# EAGLE schematic M8650D+cpld+ (EAGLE 6.6.0)

## Sheet 1 of 3
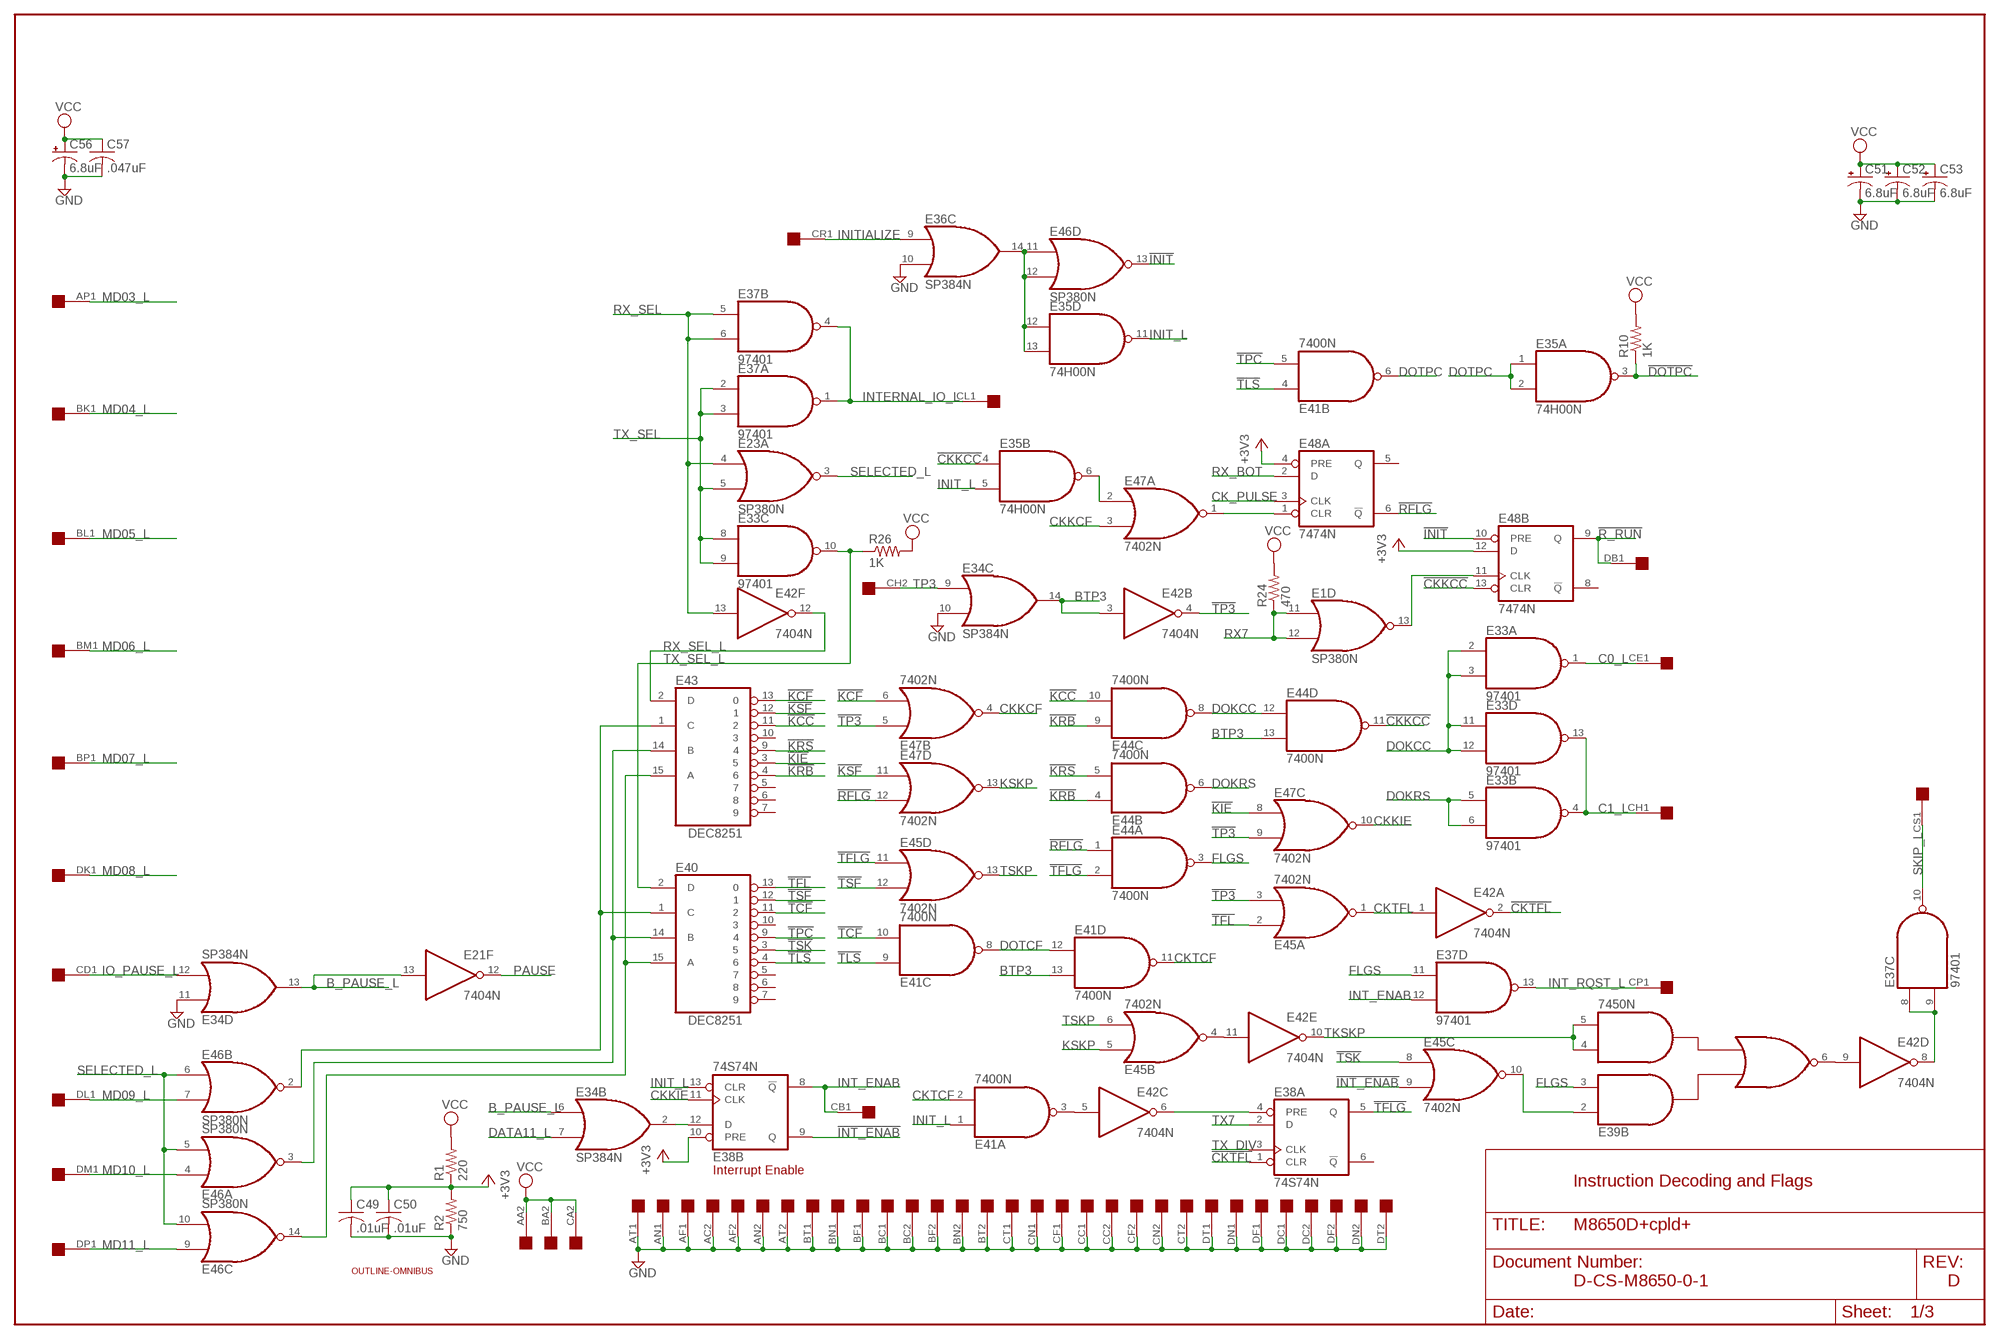
[diagram p0: schematic, sheet 1]

### Parts
C49  .01uF  C-US050-025X075  [C050-025X075]
C50  .01uF  C-US050-025X075  [C050-025X075]
C51  6.8uF  CPOL-USE20-8AXIAL  [E12-8]
C52  6.8uF  CPOL-USE20-8AXIAL  [E12-8]
C53  6.8uF  CPOL-USE20-8AXIAL  [E12-8]
C56  6.8uF  CPOL-USE20-8AXIAL  [E12-8]
C57  .047uF  C-US050-025X075  [C050-025X075]
E1  SP380N  [DIL14]
E21  7404N  [DIL14]
E23  SP380N  [DIL14]
E33  97401  74LS01N  [DIL14]
E34  SP384N  [DIL14]
E35  74H00N  7400N  [DIL14]
E36  SP384N  [DIL14]
E37  97401  74LS01N  [DIL14]
E38  74S74N  [DIL14]
E39  7450N  [DIL14]
E40  DEC8251  [DIL16]
E41  7400N  [DIL14]
E42  7404N  [DIL14]
E43  DEC8251  [DIL16]
E44  7400N  [DIL14]
E45  7402N  [DIL14]
E46  SP380N  [DIL14]
E47  7402N  [DIL14]
E48  7474N  74S74N  [DIL14]
R1  220  R-US_0207/10  [0207/10]
R2  750  R-US_0207/10  [0207/10]
R10  1K  R-US_0207/10  [0207/10]
R24  470  R-US_0207/10  [0207/10]
R26  1K  R-US_0207/10  [0207/10]
U$1  OUTLINE-OMNIBUS  [OMNIBUS]
U$2  OMNIBUS  QUAD  [EDGE-CON8]

### Nets
!CKKCC: E35.4(B:I0) E44.11(D:O) E48.13(B:CLR)
!CKTFL: E38.1(A:CLR) E42.2(A:O)
!DOTPC: E35.3(A:O) R10.1 ; also sheet 2
!INIT: E46.13(D:O) E48.10(B:PRE) ; also sheet 2
!INT_ENAB: E38.9(B:Q) E45.9(C:I1)
!KCC: E43.11 E44.10(C:I1)
!KCF: E43.13 E47.6(B:I1)
!KIE: E43.3 E47.8(C:I0)
!KRB: E43.4 E44.4(B:I0) E44.9(C:I0)
!KRS: E43.9 E44.5(B:I1)
!KSF: E43.12 E47.11(D:I0)
!R_RUN: E48.9(B:Q) U$2.DB1
!RFLG: E44.1(A:I0) E47.12(D:I1) E48.6(A:!Q)
!TCF: E40.11 E41.10(C:I1)
!TFL: E40.13 E45.2(A:I0)
!TFLG: E38.5(A:Q) E44.2(A:I1) E45.11(D:I0)
!TLS: E40.4 E41.4(B:I0) E41.9(C:I0)
!TP3: E42.4(B:O) E45.3(A:I1) E47.5(B:I0) E47.9(C:I1)
!TPC: E40.9 E41.5(B:I1)
!TSF: E40.12 E45.12(D:I1)
!TSK: E40.3 E45.8(C:I0)
+3V3 [Supply]: C49.1 C50.1 E38.10(B:PRE) E48.4(A:PRE) E48.12(B:D) R1.1 R2.2 ; also sheet 2
B_PAUSE_L: E21.13(F:I) E34.6(B:I0) E34.13(D:O)
BTP3: E34.14(C:O) E41.13(D:I1) E42.3(B:I) E44.13(D:I1) ; also sheet 2
C0_L: E33.1(A:O) U$2.CE1
C1_L: E33.4(B:O) E33.13(D:O) U$2.CH1
CK_PULSE: E48.3(A:CLK) ; also sheet 2
CKKCF: E47.3(A:I1) E47.4(B:O)
CKKIE: E38.11(B:CLK) E47.10(C:O)
CKTCF: E41.2(A:I1) E41.11(D:O)
CKTFL: E42.1(A:I) E45.1(A:O)
DATA11_L: E34.7(B:I1) ; also sheet 2
DOKCC: E33.2(A:I0) E33.3(A:I1) E33.11(D:I0) E33.12(D:I1) E44.8(C:O) E44.12(D:I0)
DOKRS: E33.5(B:I0) E33.6(B:I1) E44.6(B:O) ; also sheet 2
DOTCF: E41.8(C:O) E41.12(D:I0)
DOTPC: E35.1(A:I0) E35.2(A:I1) E41.6(B:O) ; also sheet 2,3
FLGS: E37.11(D:I0) E39.3(B:I2) E44.3(A:O)
GND [Supply]: C49.2 C50.2 C51.- C52.- C53.- C56.- C57.2 E34.10(C:I1) E34.11(D:I0) E36.10(C:I1) R2.1 U$2.AC2 U$2.AF1 U$2.AF2 U$2.AN1 U$2.AN2 U$2.AT1 U$2.AT2 U$2.BC1 U$2.BC2 U$2.BF1 U$2.BF2 U$2.BN1 U$2.BN2 U$2.BT1 U$2.BT2 U$2.CC1 U$2.CC2 U$2.CF1 U$2.CF2 U$2.CN1 U$2.CN2 U$2.CT1 U$2.CT2 U$2.DC1 U$2.DC2 U$2.DF1 U$2.DF2 U$2.DN1 U$2.DN2 U$2.DT1 U$2.DT2 ; also sheet 2,3
INIT_L: E35.5(B:I1) E35.11(D:O) E38.13(B:CLR) E41.1(A:I0) ; also sheet 2
INITIALIZE: E36.9(C:I0) U$2.CR1
INT_ENAB: E37.12(D:I1) E38.8(B:!Q) U$2.CB1
INT_RQST_L: E37.13(D:O) U$2.CP1
INTERNAL_IO_L: E37.1(A:O) E37.4(B:O) U$2.CL1
IO_PAUSE_L: E34.12(D:I1) U$2.CD1
KSKP: E45.5(B:I0) E47.13(D:O)
MD03_L: U$2.AP1 ; also sheet 3
MD04_L: U$2.BK1 ; also sheet 3
MD05_L: U$2.BL1 ; also sheet 3
MD06_L: U$2.BM1 ; also sheet 3
MD07_L: U$2.BP1 ; also sheet 3
MD08_L: U$2.DK1 ; also sheet 3
MD09_L: E46.7(B:I1) U$2.DL1
MD10_L: E46.4(A:I0) U$2.DM1
MD11_L: E46.9(C:I0) U$2.DP1
N$8: E34.2(B:O) E38.12(B:D)
N$10: E42.11(E:I) E45.4(B:O)
N$14: E35.12(D:I0) E35.13(D:I1) E36.14(C:O) E46.11(D:I0) E46.12(D:I1)
N$16: E41.3(A:O) E42.5(C:I)
N$17: E38.4(A:PRE) E42.6(C:O)
N$19: E39.2(B:I1) E45.10(C:O)
N$20: E39.6(B:O) E42.9(D:I)
N$21: E40.14(B) E43.14(B) E46.3(A:O)
N$22: E37.8(C:I0) E37.9(C:I1) E42.8(D:O)
N$23: E40.1(C) E43.1(C) E46.2(B:O)
N$25: E40.15(A) E43.15(A) E46.14(C:O)
N$26: E1.13(D:O) E48.11(B:CLK)
N$28: E47.1(A:O) E48.1(A:CLR)
N$29: E35.6(B:O) E47.2(A:I0)
PAUSE: E21.12(F:O) ; also sheet 3
RX7: E1.11(D:I0) E1.12(D:I1) R24.1 ; also sheet 2
RX_BOT: E48.2(A:D) ; also sheet 2
RX_SEL: E23.4(A:I0) E37.5(B:I0) E37.6(B:I1) E42.13(F:I) ; also sheet 3
RX_SEL_L: E42.12(F:O) E43.2(D)
SELECTED_L: E23.3(A:O) E46.5(A:I1) E46.6(B:I0) E46.10(C:I1)
SKIP_L: E37.10(C:O) U$2.CS1
TKSKP: E39.4(B:I3) E39.5(B:I4) E42.10(E:O)
TP3: E34.9(C:I0) U$2.CH2 ; also sheet 3
TSKP: E45.6(B:I1) E45.13(D:O)
TX7: E38.2(A:D) ; also sheet 2
TX_DIV: E38.3(A:CLK) ; also sheet 2
TX_SEL: E23.5(A:I1) E33.8(C:I0) E33.9(C:I1) E37.2(A:I0) E37.3(A:I1) ; also sheet 3
TX_SEL_L: E33.10(C:O) E40.2(D) R26.1
VCC [Supply]: C51.+ C52.+ C53.+ C56.+ C57.1 R1.2 R10.2 R24.2 R26.2 U$2.AA2 U$2.BA2 U$2.CA2 ; also sheet 2,3
Unconnected: E1.2(B:O) E1.6(B:I0) E1.7(B:I1) E1.9(C:I0) E1.10(C:I1) E1.14(C:O) E34.3(A:O) E34.4(A:I0) E34.5(A:I1) E36.2(B:O) E36.6(B:I0) E36.7(B:I1) E38.6(A:!Q) E40.5 E40.6 E40.7 E40.10 E43.5 E43.6 E43.7 E43.10 E48.5(A:Q) E48.8(B:!Q) U$2.AA1 U$2.AB2 U$2.AC1 U$2.AD1 U$2.AD2 U$2.AE1 U$2.AE2 U$2.AH1 U$2.AH2 U$2.AJ1 U$2.AJ2 U$2.AK1 U$2.AK2 U$2.AL1 U$2.AL2 U$2.AM1 U$2.AM2 U$2.AP2 U$2.AR1 U$2.AR2 U$2.AS1 U$2.AS2 U$2.AU1 U$2.AU2 U$2.AV1 U$2.AV2 U$2.BB2 U$2.BD1 U$2.BD2 U$2.BE1 U$2.BE2 U$2.BH1 U$2.BH2 U$2.BJ1 U$2.BJ2 U$2.BK2 U$2.BL2 U$2.BM2 U$2.BP2 U$2.BR2 U$2.BS2 U$2.BU2 U$2.CB2 U$2.CD2 U$2.CE2 U$2.CJ1 U$2.CJ2 U$2.CK1 U$2.CK2 U$2.CL2 U$2.CM1 U$2.CM2 U$2.CP2 U$2.CR2 U$2.CS2 U$2.CU1 U$2.CU2 U$2.CV1 U$2.CV2 U$2.DA1 U$2.DA2 U$2.DB2 U$2.DD1 U$2.DD2 U$2.DE1 U$2.DE2 U$2.DH1 U$2.DH2 U$2.DJ1 U$2.DJ2 U$2.DK2 U$2.DL2 U$2.DM2 U$2.DP2 U$2.DR2 U$2.DS2 U$2.DU2 U$2.DV2

### Notes on the sheet
- Interrupt Enable
- Instruction Decoding and Flags
- D-CS-M8650-0-1 | D

## Sheet 2 of 3
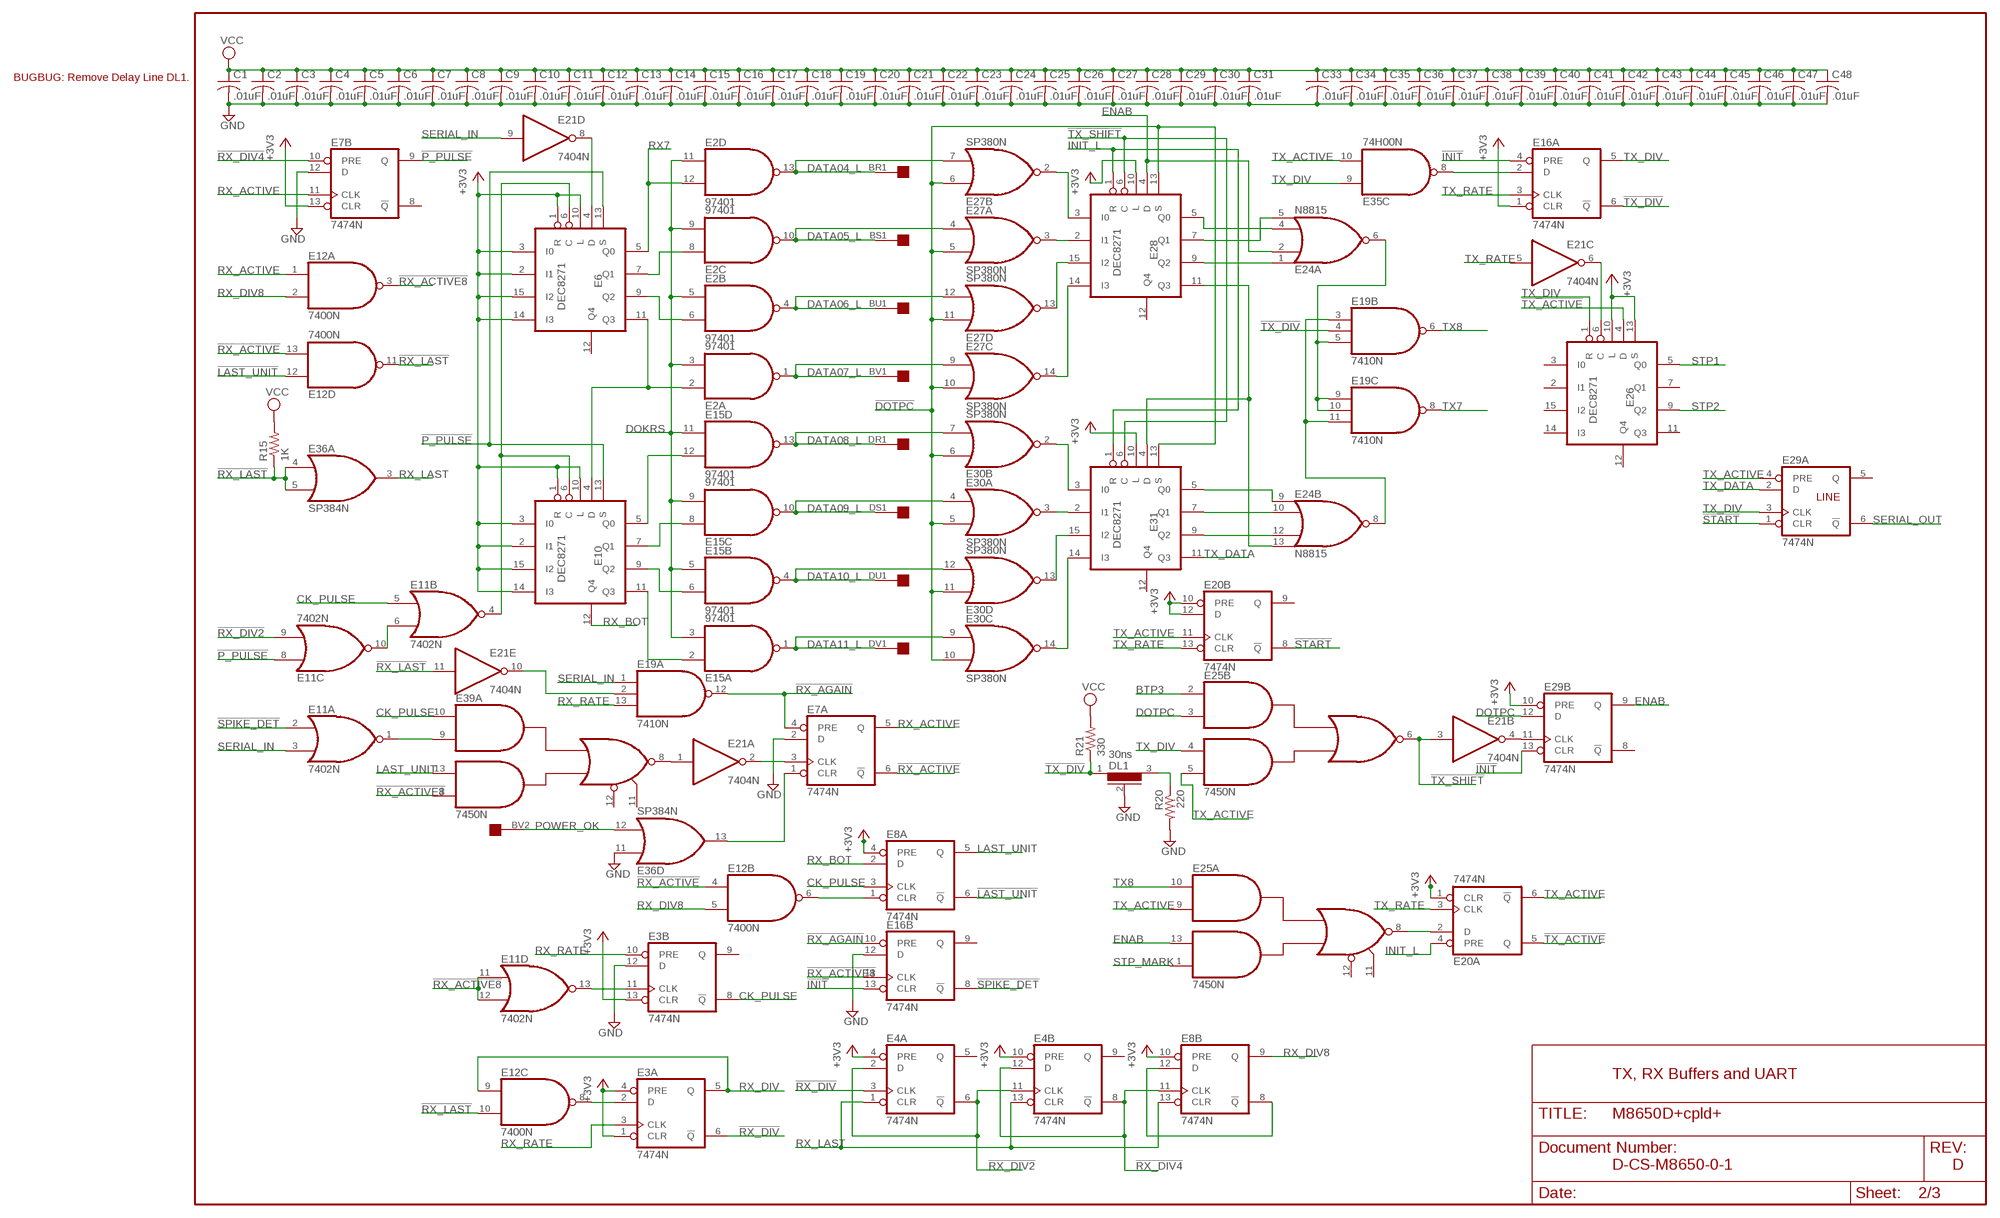
[diagram p1: schematic, sheet 2]

### Parts
C1  .01uF  C-US050-025X075  [C050-025X075]
C2  .01uF  C-US050-025X075  [C050-025X075]
C3  .01uF  C-US050-025X075  [C050-025X075]
C4  .01uF  C-US050-025X075  [C050-025X075]
C5  .01uF  C-US050-025X075  [C050-025X075]
C6  .01uF  C-US050-025X075  [C050-025X075]
C7  .01uF  C-US050-025X075  [C050-025X075]
C8  .01uF  C-US050-025X075  [C050-025X075]
C9  .01uF  C-US050-025X075  [C050-025X075]
C10  .01uF  C-US050-025X075  [C050-025X075]
C11  .01uF  C-US050-025X075  [C050-025X075]
C12  .01uF  C-US050-025X075  [C050-025X075]
C13  .01uF  C-US050-025X075  [C050-025X075]
C14  .01uF  C-US050-025X075  [C050-025X075]
C15  .01uF  C-US050-025X075  [C050-025X075]
C16  .01uF  C-US050-025X075  [C050-025X075]
C17  .01uF  C-US050-025X075  [C050-025X075]
C18  .01uF  C-US050-025X075  [C050-025X075]
C19  .01uF  C-US050-025X075  [C050-025X075]
C20  .01uF  C-US050-025X075  [C050-025X075]
C21  .01uF  C-US050-025X075  [C050-025X075]
C22  .01uF  C-US050-025X075  [C050-025X075]
C23  .01uF  C-US050-025X075  [C050-025X075]
C24  .01uF  C-US050-025X075  [C050-025X075]
C25  .01uF  C-US050-025X075  [C050-025X075]
C26  .01uF  C-US050-025X075  [C050-025X075]
C27  .01uF  C-US050-025X075  [C050-025X075]
C28  .01uF  C-US050-025X075  [C050-025X075]
C29  .01uF  C-US050-025X075  [C050-025X075]
C30  .01uF  C-US050-025X075  [C050-025X075]
C31  .01uF  C-US050-025X075  [C050-025X075]
C33  .01uF  C-US050-025X075  [C050-025X075]
C34  .01uF  C-US050-025X075  [C050-025X075]
C35  .01uF  C-US050-025X075  [C050-025X075]
C36  .01uF  C-US050-025X075  [C050-025X075]
C37  .01uF  C-US050-025X075  [C050-025X075]
C38  .01uF  C-US050-025X075  [C050-025X075]
C39  .01uF  C-US050-025X075  [C050-025X075]
C40  .01uF  C-US050-025X075  [C050-025X075]
C41  .01uF  C-US050-025X075  [C050-025X075]
C42  .01uF  C-US050-025X075  [C050-025X075]
C43  .01uF  C-US050-025X075  [C050-025X075]
C44  .01uF  C-US050-025X075  [C050-025X075]
C45  .01uF  C-US050-025X075  [C050-025X075]
C46  .01uF  C-US050-025X075  [C050-025X075]
C47  .01uF  C-US050-025X075  [C050-025X075]
C48  .01uF  C-US050-025X075  [C050-025X075]
DL1  30ns  RCL-L-00-05  [RCL-L-00-05]
E2  97401  74LS01N  [DIL14]
E3  7474N  74S74N  [DIL14]
E4  7474N  74S74N  [DIL14]
E6  DEC8271  [DIL16]
E7  7474N  74S74N  [DIL14]
E8  7474N  74S74N  [DIL14]
E10  DEC8271  [DIL16]
E11  7402N  [DIL14]
E12  7400N  [DIL14]
E15  97401  74LS01N  [DIL14]
E16  7474N  74S74N  [DIL14]
E19  7410N  [DIL14]
E20  7474N  74S74N  [DIL14]
E24  N8815  [DIL14]
E25  7450N  [DIL14]
E26  DEC8271  [DIL16]
E27  SP380N  [DIL14]
E28  DEC8271  [DIL16]
E29  7474N  74S74N  [DIL14]
E30  SP380N  [DIL14]
E31  DEC8271  [DIL16]
R15  1K  R-US_0207/10  [0207/10]
R20  220  R-US_0207/10  [0207/10]
R21  330  R-US_0207/10  [0207/10]

### Nets
!DOTPC: E27.5(A:I1) E27.6(B:I0) E27.10(C:I1) E27.11(D:I0) E28.13(S) E30.5(A:I1) E30.6(B:I0) E30.10(C:I1) E30.11(D:I0) E31.13(S) ; also sheet 1
!INIT: E16.4(A:PRE) E16.13(B:CLR) E29.13(B:CLR) ; also sheet 1
!LAST_UNIT: E8.6(A:!Q) E12.12(D:I0)
!P_PULSE: E6.13(S) E7.9(B:Q) E10.13(S) E11.8(C:I0)
!RX_ACTIVE: E7.6(A:!Q) E12.4(B:I0) E12.13(D:I1)
!RX_ACTIVE8: E11.11(D:I0) E11.12(D:I1) E12.3(A:O) E16.11(B:CLK) E39.1(A:I4)
!RX_AGAIN: E7.4(A:PRE) E16.10(B:PRE) E19.12(A:O)
!RX_DIV: E3.6(A:!Q) E4.3(A:CLK)
!RX_DIV2: E4.2(A:D) E4.6(A:!Q) E4.11(B:CLK) E11.9(C:I1)
!RX_DIV4: E4.8(B:!Q) E4.12(B:D) E7.10(B:PRE) E8.11(B:CLK)
!RX_LAST: E12.10(C:I1) E12.11(D:O) E21.11(E:I) E36.4(A:I0) E36.5(A:I1) R15.1
!SPIKE_DET: E11.2(A:I0) E16.8(B:!Q)
!START: E20.8(B:!Q) E29.1(A:CLR)
!TX_ACTIVE: E20.5(A:Q) E26.4(D)
!TX_DIV: DL1.1 E16.6(A:!Q) E19.4(B:I1) R21.1
!TX_SHIFT: E21.3(B:I) E25.6(B:O) E28.6(C) E31.6(C)
+3V3 [Supply]: E3.1(A:CLR) E3.4(A:PRE) E3.13(B:CLR) E4.4(A:PRE) E4.10(B:PRE) E6.1(R) E6.2(I1) E6.3(I0) E6.10(L) E6.14(I3) E6.15(I2) E7.13(B:CLR) E8.4(A:PRE) E8.10(B:PRE) E10.1(R) E10.2(I1) E10.3(I0) E10.10(L) E10.14(I3) E10.15(I2) E16.1(A:CLR) E20.1(A:CLR) E20.10(B:PRE) E20.12(B:D) E26.10(L) E26.13(S) E28.10(L) E29.10(B:PRE) E31.10(L) ; also sheet 1
BTP3: E25.2(B:I1) ; also sheet 1
CK_PULSE: E3.8(B:!Q) E8.3(A:CLK) E11.5(B:I0) E39.10(A:I1) ; also sheet 1
DATA04_L: E2.13(D:O) E27.7(B:I1) U$2.BR1
DATA05_L: E2.10(C:O) E27.4(A:I0) U$2.BS1
DATA06_L: E2.4(B:O) E27.12(D:I1) U$2.BU1
DATA07_L: E2.1(A:O) E27.9(C:I0) U$2.BV1
DATA08_L: E15.13(D:O) E30.7(B:I1) U$2.DR1
DATA09_L: E15.10(C:O) E30.4(A:I0) U$2.DS1
DATA10_L: E15.4(B:O) E30.12(D:I1) U$2.DU1
DATA11_L: E15.1(A:O) E30.9(C:I0) U$2.DV1 ; also sheet 1
DOKRS: E2.3(A:I1) E2.5(B:I0) E2.9(C:I1) E2.11(D:I0) E15.3(A:I1) E15.5(B:I0) E15.9(C:I1) E15.11(D:I0) ; also sheet 1
DOTPC: E25.3(B:I2) E29.12(B:D) ; also sheet 1,3
ENAB: E24.2(A:I1) E25.13(A:I3) E28.4(D) E29.9(B:Q)
GND [Supply]: C1.2 C2.2 C3.2 C4.2 C5.2 C6.2 C7.2 C8.2 C9.2 C10.2 C11.2 C12.2 C13.2 C14.2 C15.2 C16.2 C17.2 C18.2 C19.2 C20.2 C21.2 C22.2 C23.2 C24.2 C25.2 C26.2 C27.2 C28.2 C29.2 C30.2 C31.2 C33.2 C34.2 C35.2 C36.2 C37.2 C38.2 C39.2 C40.2 C41.2 C42.2 C43.2 C44.2 C45.2 C46.2 C47.2 C48.2 DL1.2 E3.12(B:D) E7.2(A:D) E7.12(B:D) E16.12(B:D) E36.11(D:I0) R20.2 ; also sheet 1,3
INIT_L: E20.4(A:PRE) E28.1(R) E31.1(R) ; also sheet 1
LAST_UNIT: E8.5(A:Q) E39.13(A:I3)
N$34: E2.8(C:I0) E6.7(Q1)
N$35: E2.2(A:I0) E6.11(Q3) E10.4(D)
N$36: E2.6(B:I1) E6.9(Q2)
N$37: E10.5(Q0) E15.12(D:I1)
N$38: E10.7(Q1) E15.8(C:I0)
N$39: E10.9(Q2) E15.6(B:I1)
N$40: E10.11(Q3) E15.2(A:I0)
N$41: E6.6(C) E10.6(C) E11.4(B:O)
N$42: E11.6(B:I1) E11.10(C:O)
N$44: E6.4(D) E21.8(D:O)
N$46: E27.2(B:O) E28.3(I0)
N$47: E27.3(A:O) E28.2(I1)
N$48: E27.13(D:O) E28.15(I2)
N$49: E27.14(C:O) E28.14(I3)
N$52: E30.2(B:O) E31.3(I0)
N$53: E30.3(A:O) E31.2(I1)
N$54: E30.13(D:O) E31.15(I2)
N$55: E30.14(C:O) E31.14(I3)
N$56: E24.1(A:I0) E28.9(Q2)
N$60: E24.4(A:I2) E28.5(Q0)
N$61: E24.13(B:I3) E28.11(Q3) E31.4(D)
N$62: E24.5(A:I3) E28.7(Q1)
N$63: E24.9(B:I0) E31.5(Q0)
N$65: E24.10(B:I1) E31.7(Q1)
N$66: E24.12(B:I2) E31.9(Q2)
N$67: E7.3(A:CLK) E21.2(A:O)
N$68: E19.3(B:I0) E19.11(C:I2) E24.8(B:O)
N$69: E19.5(B:I2) E19.9(C:I0) E19.10(C:I1) E24.6(A:O)
N$70: E21.1(A:I) E39.8(A:O)
N$72: E7.1(A:CLR) E36.13(D:O)
N$76: E3.2(A:D) E12.8(C:O)
N$78: E19.2(A:I1) E21.10(E:O)
N$81: E11.1(A:O) E39.9(A:I2)
N$82: E3.11(B:CLK) E11.13(D:O)
N$87: E8.8(B:!Q) E8.12(B:D)
N$91: E8.1(A:CLR) E12.6(B:O)
N$94: E16.2(A:D) E35.8(C:O)
N$102: E21.4(B:O) E29.11(B:CLK)
N$103: DL1.3 R20.1
N$108: E20.2(A:D) E25.8(A:O)
N$145: E21.6(C:O) E26.6(C)
POWER_OK: E36.12(D:I1) U$2.BV2
RX7: E2.12(D:I1) E6.5(Q0) ; also sheet 1
RX_ACTIVE: E7.5(A:Q) E7.11(B:CLK) E12.1(A:I0) ; also sheet 3
RX_BOT: E8.2(A:D) E10.12(Q4) ; also sheet 1
RX_DIV: E3.5(A:Q) E12.9(C:I0)
RX_DIV8: E8.9(B:Q) E12.2(A:I1) E12.5(B:I1)
RX_LAST: E4.1(A:CLR) E4.13(B:CLR) E8.13(B:CLR) E36.3(A:O)
RX_RATE: E3.3(A:CLK) E3.10(B:PRE) E19.13(A:I2) ; also sheet 3
SERIAL_IN: E11.3(A:I1) E19.1(A:I0) E21.9(D:I) ; also sheet 3
SERIAL_OUT: E29.6(A:!Q) ; also sheet 3
STP1: E26.5(Q0) ; also sheet 3
STP2: E26.9(Q2) ; also sheet 3
STP_MARK: E25.1(A:I4) ; also sheet 3
TX7: E19.8(C:O) ; also sheet 1
TX8: E19.6(B:O) E25.10(A:I1)
TX_ACTIVE: E20.6(A:!Q) E20.11(B:CLK) E25.5(B:I4) E25.9(A:I2) E29.4(A:PRE) E35.10(C:I1) ; also sheet 3
TX_DATA: E29.2(A:D) E31.11(Q3)
TX_DIV: E16.5(A:Q) E25.4(B:I3) E26.1(R) E29.3(A:CLK) E35.9(C:I0) ; also sheet 1
TX_RATE: E16.3(A:CLK) E20.3(A:CLK) E20.13(B:CLR) E21.5(C:I) ; also sheet 3
VCC [Supply]: C1.1 C2.1 C3.1 C4.1 C5.1 C6.1 C7.1 C8.1 C9.1 C10.1 C11.1 C12.1 C13.1 C14.1 C15.1 C16.1 C17.1 C18.1 C19.1 C20.1 C21.1 C22.1 C23.1 C24.1 C25.1 C26.1 C27.1 C28.1 C29.1 C30.1 C31.1 C33.1 C34.1 C35.1 C36.1 C37.1 C38.1 C39.1 C40.1 C41.1 C42.1 C43.1 C44.1 C45.1 C46.1 C47.1 C48.1 R15.2 R21.2 ; also sheet 1,3
Unconnected: E3.9(B:Q) E4.5(A:Q) E4.9(B:Q) E6.12(Q4) E7.8(B:!Q) E16.9(B:Q) E20.9(B:Q) E25.11(A:I6) E25.12(A:I5) E26.2(I1) E26.3(I0) E26.7(Q1) E26.11(Q3) E26.12(Q4) E26.14(I3) E26.15(I2) E28.12(Q4) E29.5(A:Q) E29.8(B:!Q) E31.12(Q4) E39.11(A:I6) E39.12(A:I5)

### Notes on the sheet
- BUGBUG: Remove Delay Line DL1.
- LINE
- TX, RX Buffers and UART
- D-CS-M8650-0-1 | D

## Sheet 3 of 3
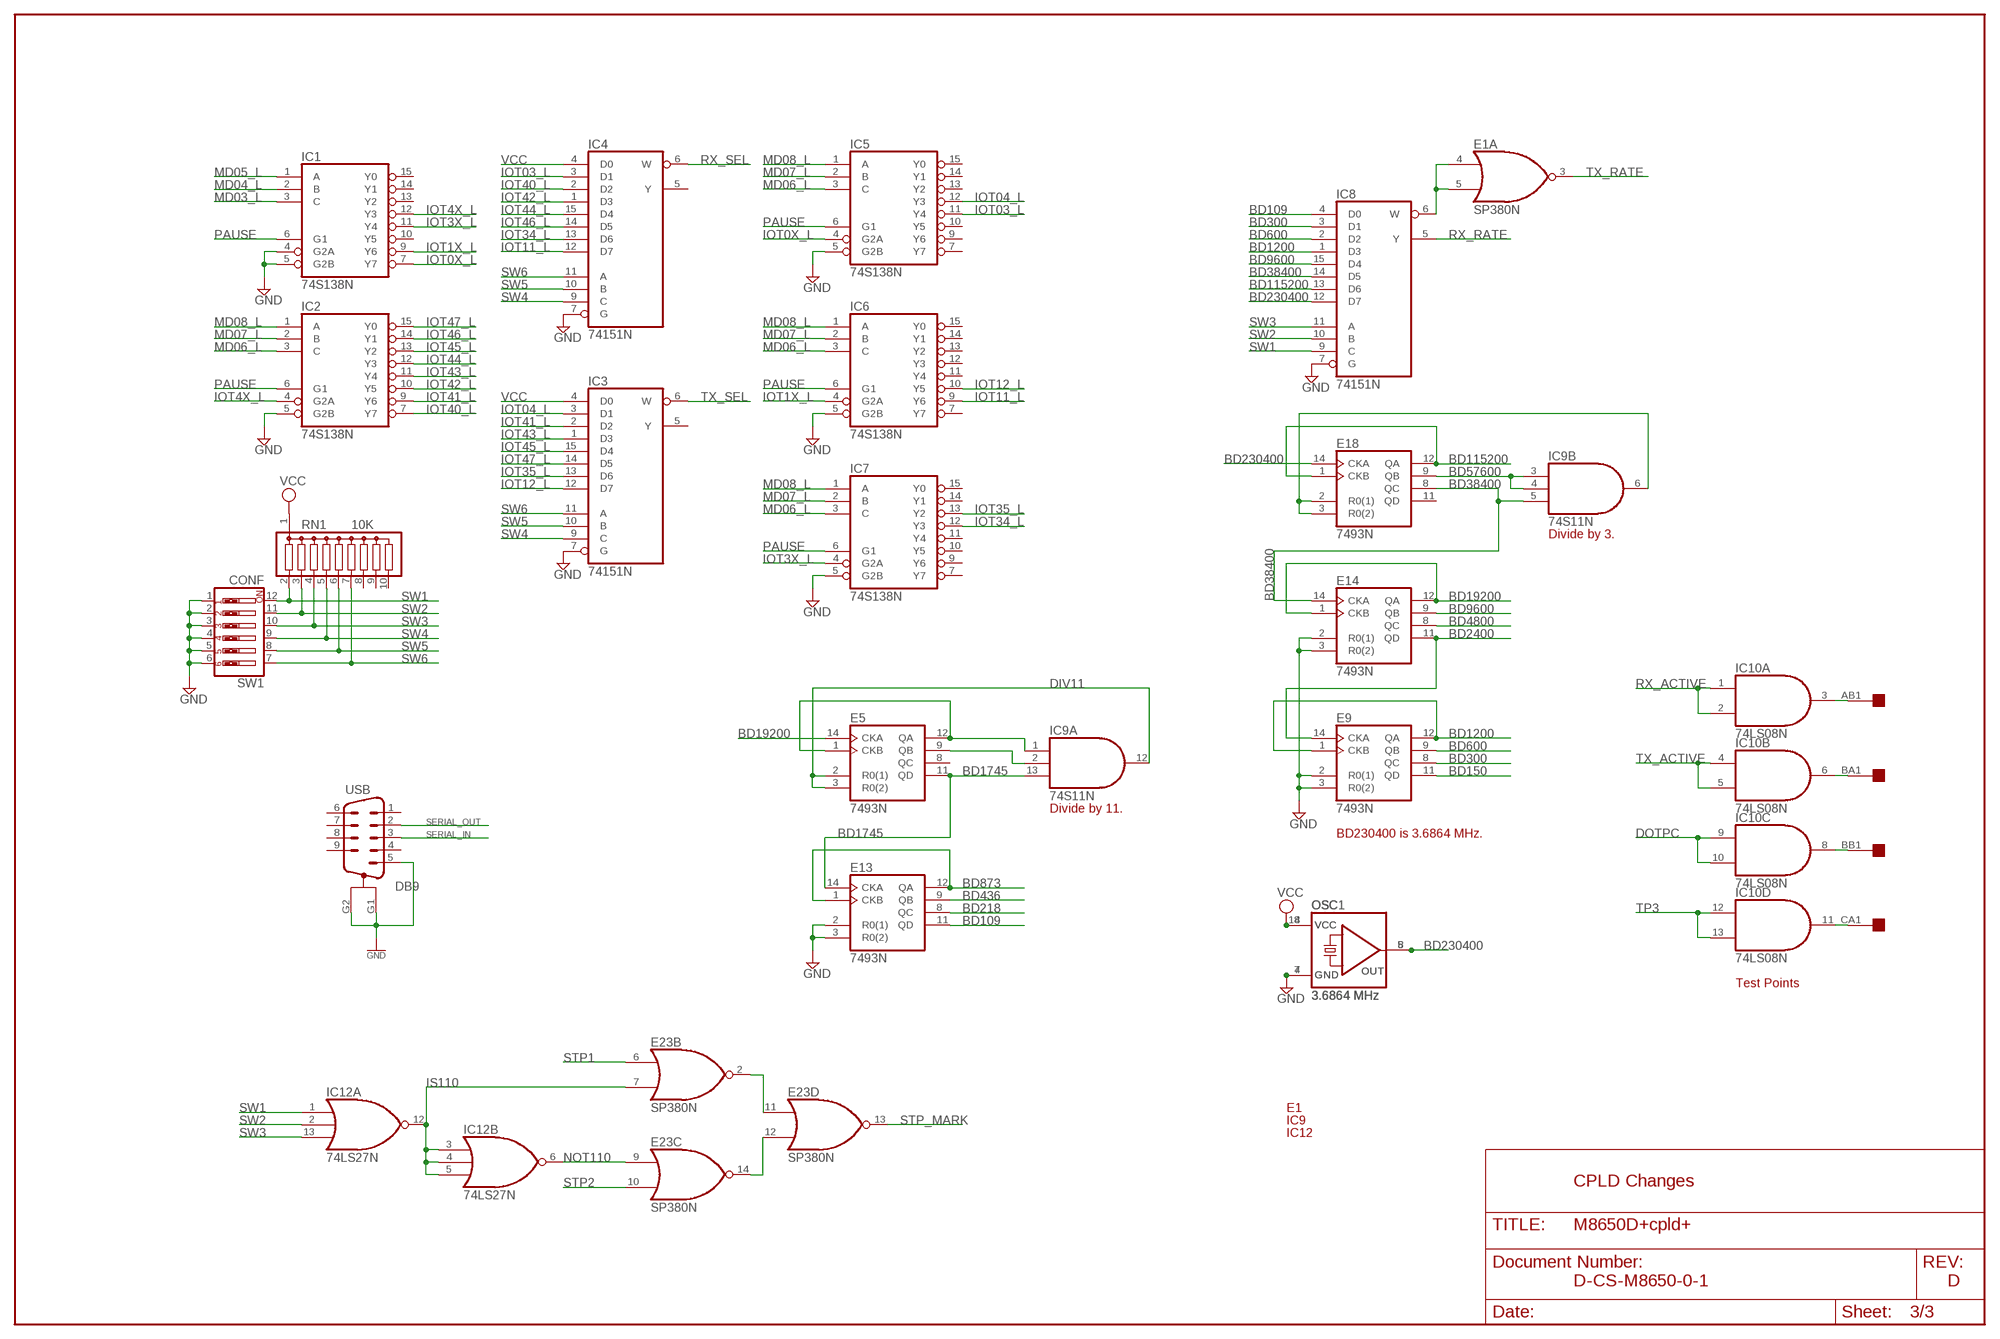
[diagram p2: schematic, sheet 3]

### Parts
E5  7493N  74LS93N  [DIL14]
E9  7493N  74LS93N  [DIL14]
E13  7493N  74LS93N  [DIL14]
E14  7493N  74LS93N  [DIL14]
E18  7493N  74LS93N  [DIL14]
IC1  74S138N  [DIL16]
IC2  74S138N  [DIL16]
IC3  74151N  74S151N  [DIL16]
IC4  74151N  74S151N  [DIL16]
IC5  74S138N  [DIL16]
IC6  74S138N  [DIL16]
IC7  74S138N  [DIL16]
IC8  74151N  [DIL16]
IC9  74S11N  [DIL14]
IC10  74LS08N  [DIL14]
IC12  74LS27N  [DIL14]
OSC  3.6864 MHz  QG5460  [DIL08S]
OSC1  3.6864 MHz  QG5860  [DIL14S]
RN1  10K  G09R  [SIL10]
SW1  CONF  SW_DIP-6  [EDG-06]
USB  DB9  [AMP_DB-9RA]

### Nets
BD109: E13.11(QD) IC8.4(D0)
BD150: E9.11(QD)
BD218: E13.8(QC)
BD300: E9.8(QC) IC8.3(D1)
BD436: E13.9(QB)
BD600: E9.9(QB) IC8.2(D2)
BD873: E13.1(CKB) E13.12(QA)
BD1200: E9.1(CKB) E9.12(QA) IC8.1(D3)
BD1745: E5.11(QD) E13.14(CKA) IC9.13(A:I2)
BD2400: E9.14(CKA) E14.11(QD)
BD4800: E14.8(QC)
BD9600: E14.9(QB) IC8.15(D4)
BD19200: E5.14(CKA) E14.1(CKB) E14.12(QA)
BD38400: E14.14(CKA) E18.8(QC) IC8.14(D5) IC9.5(B:I2)
BD57600: E18.9(QB) IC9.3(B:I0) IC9.4(B:I1)
BD115200: E18.1(CKB) E18.12(QA) IC8.13(D6)
BD230400: E18.14(CKA) IC8.12(D7) OSC1.8(OUT) OSC.5(OUT)
DIV11: E5.2(R0(1)) E5.3(R0(2)) IC9.12(A:O)
DOTPC: IC10.9(C:I0) IC10.10(C:I1) ; also sheet 1,2
GND [Supply]: E9.2(R0(1)) E9.3(R0(2)) E13.2(R0(1)) E13.3(R0(2)) E14.2(R0(1)) E14.3(R0(2)) IC1.4(G2A) IC1.5(G2B) IC2.5(G2B) IC3.7(G) IC4.7(G) IC5.5(G2B) IC6.5(G2B) IC7.5(G2B) IC8.7(G) OSC1.7(GND) OSC.4(GND) SW1.1 SW1.2 SW1.3 SW1.4 SW1.5 SW1.6 USB.5 USB.G1 USB.G2 ; also sheet 1,2
IOT0X_L: IC1.7(Y7) IC5.4(G2A)
IOT1X_L: IC1.9(Y6) IC6.4(G2A)
IOT03_L: IC4.3(D1) IC5.11(Y4)
IOT3X_L: IC1.11(Y4) IC7.4(G2A)
IOT04_L: IC3.3(D1) IC5.12(Y3)
IOT4X_L: IC1.12(Y3) IC2.4(G2A)
IOT11_L: IC4.12(D7) IC6.9(Y6)
IOT12_L: IC3.12(D7) IC6.10(Y5)
IOT34_L: IC4.13(D6) IC7.12(Y3)
IOT35_L: IC3.13(D6) IC7.13(Y2)
IOT40_L: IC2.7(Y7) IC4.2(D2)
IOT41_L: IC2.9(Y6) IC3.2(D2)
IOT42_L: IC2.10(Y5) IC4.1(D3)
IOT43_L: IC2.11(Y4) IC3.1(D3)
IOT44_L: IC2.12(Y3) IC4.15(D4)
IOT45_L: IC2.13(Y2) IC3.15(D4)
IOT46_L: IC2.14(Y1) IC4.14(D5)
IOT47_L: IC2.15(Y0) IC3.14(D5)
IS110: E23.7(B:I1) IC12.3(B:I0) IC12.4(B:I1) IC12.5(B:I2) IC12.12(A:O)
MD03_L: IC1.3(C) ; also sheet 1
MD04_L: IC1.2(B) ; also sheet 1
MD05_L: IC1.1(A) ; also sheet 1
MD06_L: IC2.3(C) IC5.3(C) IC6.3(C) IC7.3(C) ; also sheet 1
MD07_L: IC2.2(B) IC5.2(B) IC6.2(B) IC7.2(B) ; also sheet 1
MD08_L: IC2.1(A) IC5.1(A) IC6.1(A) IC7.1(A) ; also sheet 1
N$1: E1.4(A:I0) E1.5(A:I1) IC8.6(W)
N$2: E5.1(CKB) E5.12(QA) IC9.1(A:I0)
N$3 [Supply]: E18.2(R0(1)) E18.3(R0(2)) IC9.6(B:O)
N$5: E5.9(QB) IC9.2(A:I1)
N$9: E23.12(D:I1) E23.14(C:O)
N$11: E23.2(B:O) E23.11(D:I0)
NOT110: E23.9(C:I0) IC12.6(B:O)
PAUSE: IC1.6(G1) IC2.6(G1) IC5.6(G1) IC6.6(G1) IC7.6(G1) ; also sheet 1
RX_ACTIVE: IC10.1(A:I0) IC10.2(A:I1) ; also sheet 2
RX_RATE: IC8.5(Y) ; also sheet 2
RX_SEL: IC4.6(W) ; also sheet 1
SERIAL_IN: USB.3 ; also sheet 2
SERIAL_OUT: USB.2 ; also sheet 2
STP1: E23.6(B:I0) ; also sheet 2
STP2: E23.10(C:I1) ; also sheet 2
STP_MARK: E23.13(D:O) ; also sheet 2
SW1: IC8.9(C) IC12.1(A:I0) RN1.2 SW1.12
SW2: IC8.10(B) IC12.2(A:I1) RN1.3 SW1.11
SW3: IC8.11(A) IC12.13(A:I2) RN1.4 SW1.10
SW4: IC3.9(C) IC4.9(C) RN1.5 SW1.9
SW5: IC3.10(B) IC4.10(B) RN1.6 SW1.8
SW6: IC3.11(A) IC4.11(A) RN1.7 SW1.7
TP3: IC10.12(D:I0) IC10.13(D:I1) ; also sheet 1
TP_AB1: IC10.3(A:O) U$2.AB1
TP_BA1: IC10.6(B:O) U$2.BA1
TP_BB1: IC10.8(C:O) U$2.BB1
TP_CA1: IC10.11(D:O) U$2.CA1
TX_ACTIVE: IC10.4(B:I0) IC10.5(B:I1) ; also sheet 2
TX_RATE: E1.3(A:O) ; also sheet 2
TX_SEL: IC3.6(W) ; also sheet 1
VCC [Supply]: IC3.4(D0) IC4.4(D0) OSC1.14(VCC) OSC.8(VCC) RN1.1 ; also sheet 1,2
Unconnected: E5.8(QC) E18.11(QD) IC1.10(Y5) IC1.13(Y2) IC1.14(Y1) IC1.15(Y0) IC3.5(Y) IC4.5(Y) IC5.7(Y7) IC5.9(Y6) IC5.10(Y5) IC5.13(Y2) IC5.14(Y1) IC5.15(Y0) IC6.7(Y7) IC6.11(Y4) IC6.12(Y3) IC6.13(Y2) IC6.14(Y1) IC6.15(Y0) IC7.7(Y7) IC7.9(Y6) IC7.10(Y5) IC7.11(Y4) IC7.14(Y1) IC7.15(Y0) IC9.8(C:O) IC9.9(C:I0) IC9.10(C:I1) IC9.11(C:I2) IC12.8(C:O) IC12.9(C:I0) IC12.10(C:I1) IC12.11(C:I2) RN1.8 RN1.9 RN1.10 USB.1 USB.4 USB.6 USB.7 USB.8 USB.9

### Notes on the sheet
- Divide by 3.
- Divide by 11.
- BD230400 is 3.6864 MHz.
- Test Points
- E1
- IC9
- IC12
- CPLD Changes
- D-CS-M8650-0-1 | D

## Power pins joined to a net without a drawn wire
GND: E1.1(P:GND) E2.7(P:GND) E3.7(P:GND) E4.7(P:GND) E5.10(GND) E6.8(GND) E7.7(P:GND) E8.7(P:GND) E9.10(GND) E10.8(GND) E11.7(P:GND) E12.7(P:GND) E13.10(GND) E14.10(GND) E15.7(P:GND) E16.7(P:GND) E18.10(GND) E19.7(P:GND) E20.7(P:GND) E21.7(P:GND) E23.1(P:GND) E24.7(P:GND) E25.7(P:GND) E26.8(GND) E27.1(P:GND) E28.8(GND) E29.7(P:GND) E30.1(P:GND) E31.8(GND) E33.7(P:GND) E34.1(GND) E35.7(P:GND) E36.1(GND) E37.7(P:GND) E38.7(P:GND) E39.7(P:GND) E40.8(GND) E41.7(P:GND) E42.7(P:GND) E43.8(GND) E44.7(P:GND) E45.7(P:GND) E46.1(P:GND) E47.7(P:GND) E48.7(P:GND) IC1.8(GND) IC2.8(GND) IC3.8(GND) IC4.8(GND) IC5.8(GND) IC6.8(GND) IC7.8(GND) IC8.8(GND) IC9.7(P:GND) IC10.7(P:GND) IC12.7(P:GND)
VCC: E1.8(P:VCC) E2.14(P:VCC) E3.14(P:VCC) E4.14(P:VCC) E5.5(VCC) E6.16(VCC) E7.14(P:VCC) E8.14(P:VCC) E9.5(VCC) E10.16(VCC) E11.14(P:VCC) E12.14(P:VCC) E13.5(VCC) E14.5(VCC) E15.14(P:VCC) E16.14(P:VCC) E18.5(VCC) E19.14(P:VCC) E20.14(P:VCC) E21.14(P:VCC) E23.8(P:VCC) E24.14(P:VCC) E25.14(P:VCC) E26.16(VCC) E27.8(P:VCC) E28.16(VCC) E29.14(P:VCC) E30.8(P:VCC) E31.16(VCC) E33.14(P:VCC) E34.8(VCC) E35.14(P:VCC) E36.8(VCC) E37.14(P:VCC) E38.14(P:VCC) E39.14(P:VCC) E40.16(VCC) E41.14(P:VCC) E42.14(P:VCC) E43.16(VCC) E44.14(P:VCC) E45.14(P:VCC) E46.8(P:VCC) E47.14(P:VCC) E48.14(P:VCC) IC1.16(VCC) IC2.16(VCC) IC3.16(VCC) IC4.16(VCC) IC5.16(VCC) IC6.16(VCC) IC7.16(VCC) IC8.16(VCC) IC9.14(P:VCC) IC10.14(P:VCC) IC12.14(P:VCC)

## Library data of the parts
C1-C31 C33-C50 C57 = rcl:C-US: CAPACITOR, American symbol
C51-C53 C56 = dec-con:CPOL-USE20-8AXIAL: A 0.8 inch electrolytic.
DL1 = dec-con:RCL-L-00-05: RCL-L Delay Line
E1 E23 E27 E30 E46 = dec-con:SP380: Quad NOR gate (use 8640)
E2 E15 E33 E37 = 74xx-us:74*01: Quad 2-input NAND gate, open collector
E3 E4 E7 E8 E16 E20 E29 E38 E48 = 74xx-us:74*74: Dual D type positive edge triggered FLIP FLOP, preset and clear
E5 E9 E13 E14 E18 = 74xx-us:74*93: Decade, divide by twelve and binary COUNTER
E6 E10 E26 E28 E31 = dec-con:DEC8271: Parallel Load Shift Register
E11 E45 E47 = 74xx-us:74*02: Quad 2-input NOR gate
E12 E35 E41 E44 = 74xx-us:74*00: Quad 2-input NAND gate
E19 = 74xx-us:74*10: Triple 3-input NAND gate
E21 E42 = 74xx-us:74*04: Hex INVERTER
E24 = dec-con:N8815: Dual 4 Input NOR Gate
E25 E39 = dec-con:74*50: 4-2-3-2 input AND OR INVERTER gates
E34 E36 = dec-con:SP384: Quad OR gate
E40 E43 = dec-con:DEC8251: BCD Decoder
IC1 IC2 IC5-IC7 = 74xx-us:74*138: 3-line to 8-line DECODER/DEMULTIPLEXER
IC3 IC4 IC8 = 74xx-us:74*151: Data SELECTOR/MULTIPLEXER
IC9 = 74xx-us:74*11: Triple 3-input AND gate
IC10 = 74xx-us:74*08: Quad 2-input AND gate
IC12 = 74xx-us:74*27: Triple 3-input NOR gate
OSC = crystal:QG5460: CRYSTAL RESONATOR; OC_FARNELL: unknown; OC_NEWARK: unknown
OSC1 = crystal:QG5860: CRYSTAL RESONATOR; OC_FARNELL: unknown; OC_NEWARK: unknown
R1 R2 R10 R15 R20 R21 R24 R26 = rcl:R-US_: RESISTOR, American symbol
RN1 = resistor-sil:G09R: SIL RESISTOR; OC_FARNELL: unknown; OC_NEWARK: unknown
SW1 = special:SW_DIP-6: DIP SWITCH
U$1 = dec-con:OUTLINE-*: Board outlines for DEC boards.
U$2 = dec-con:QUAD: Quad-Height DEC board
USB = alan_common:DB9; MANF: TE/AMP; MANF#: 1734352-1; MOUSER#: 571-1734352-1

## Net classes
1 Supply: width 0.813 mm